# Altium schematic sheet 5-gsm.SchDoc
size B
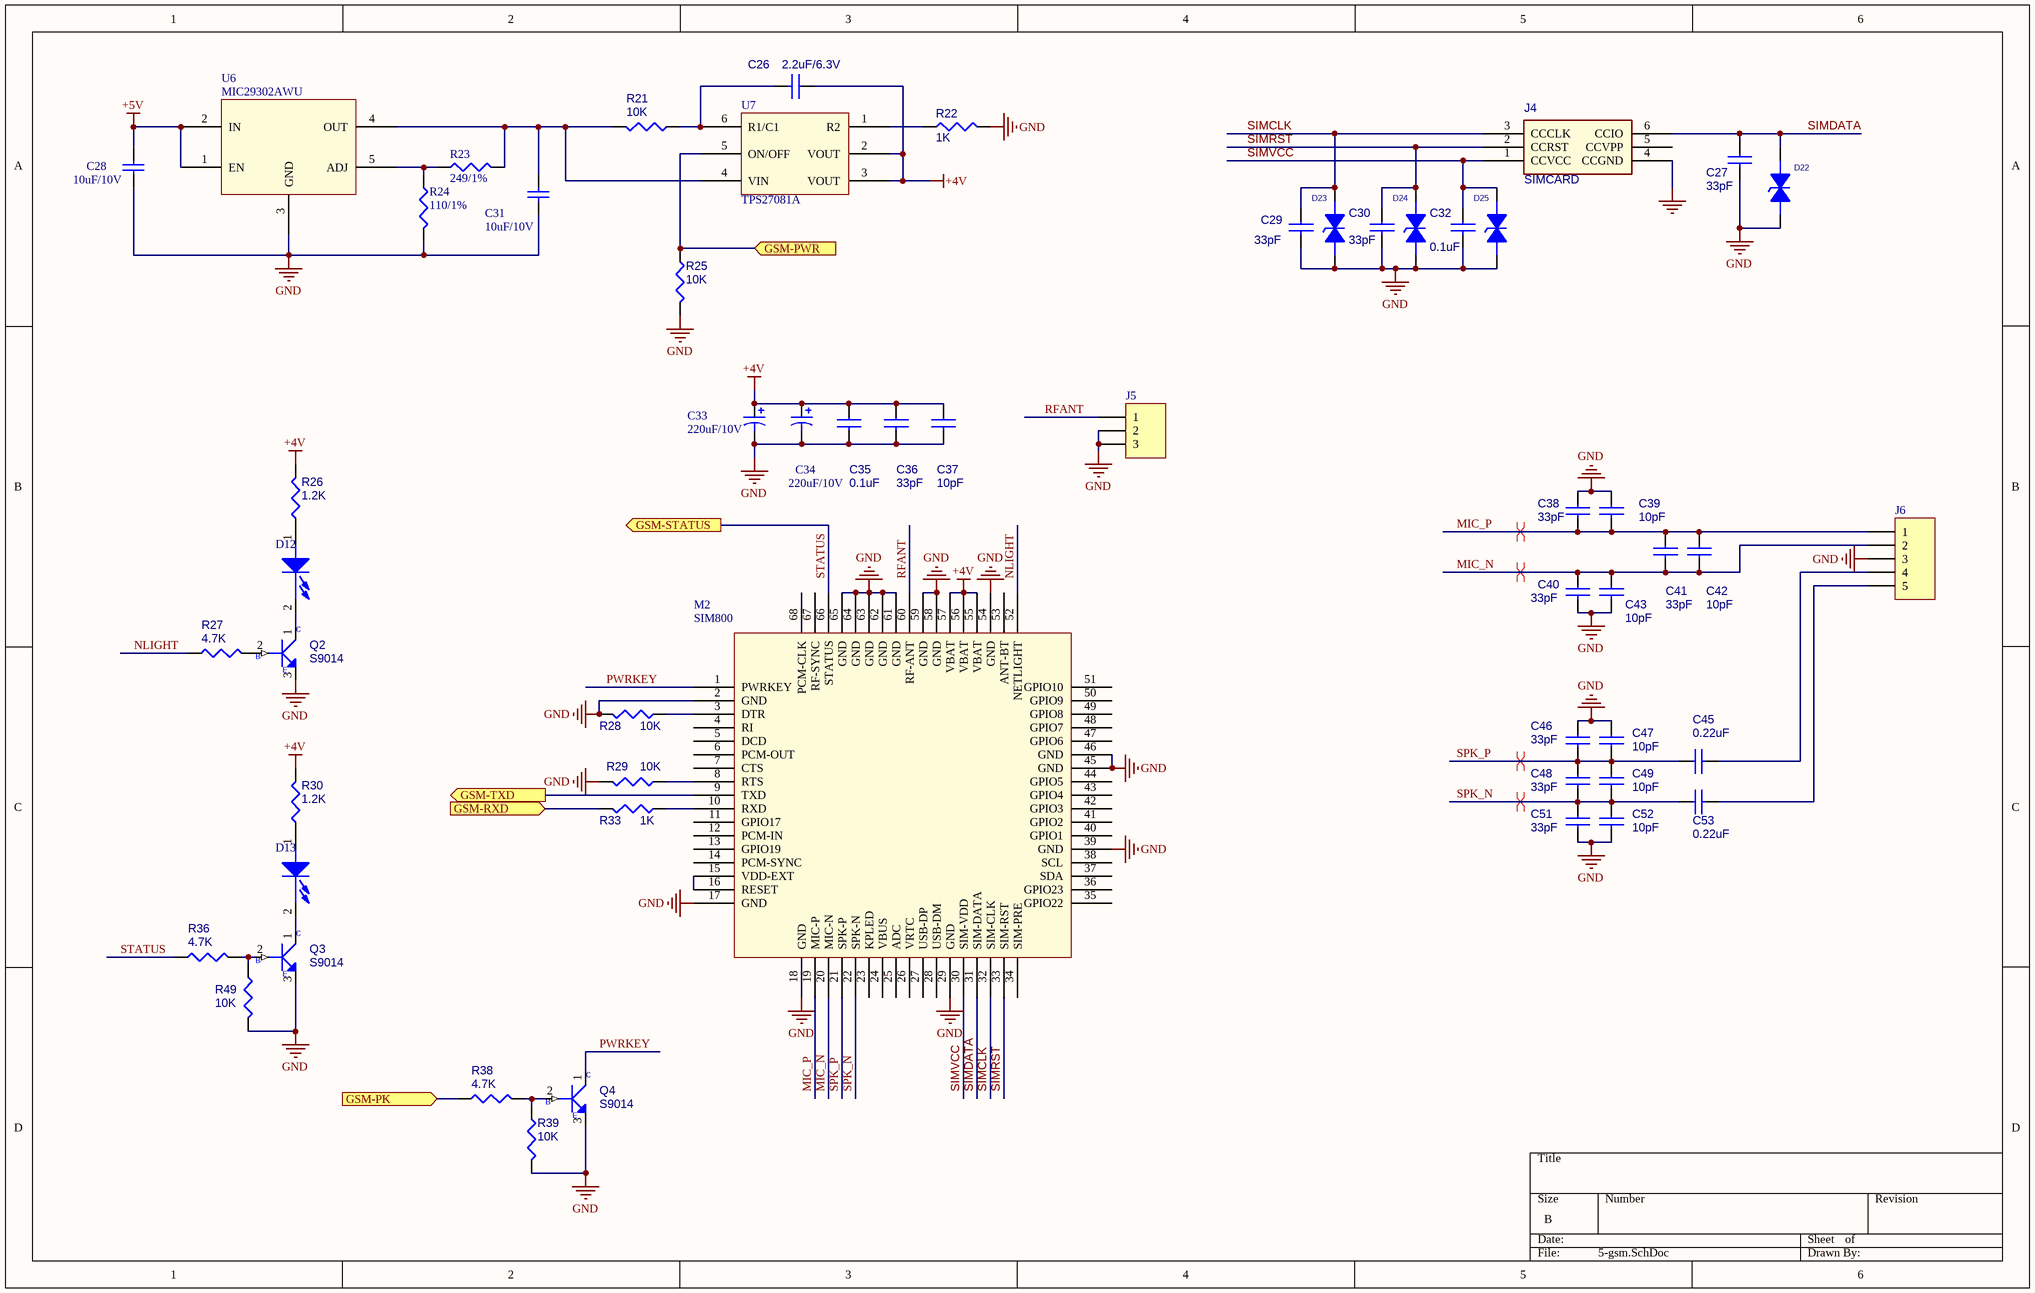
[diagram p0: 5-gsm.SchDoc]

## Parts
C26  2.2uF/6.3V  [0603]
C27  33pF  [0402]
C28  10uF/10V  [1210]
C29  33pF  [0402]
C30  33pF  [0402]
C31  10uF/10V  [1210]
C32  0.1uF  [0402]
C33  220uF/10V  [7343]
C34  220uF/10V  [7343]
C35  0.1uF  [0603]
C36  33pF  [0603]
C37  10pF  [0603]
C38  33pF  [0603]
C39  10pF  [0603]
C40  33pF  [0603]
C41  33pF  [0603]
C42  10pF  [0603]
C43  10pF  [0603]
C45  0.22uF  [0603]
C46  33pF  [0603]
C47  10pF  [0603]
C48  33pF  [0603]
C49  10pF  [0603]
C51  33pF  [0603]
C52  10pF  [0603]
C53  0.22uF  [0603]
D12  LED GREEN  [LED0603]  (value not drawn)
D13  LED GREEN  [LED0603]  (value not drawn)
D22  SMV0402G5R6N121T  [0402]  (value not drawn)
D23  SMV0402G5R6N121T  [0402]  (value not drawn)
D24  SMV0402G5R6N121T  [0402]  (value not drawn)
D25  SMV0402G5R6N121T  [0402]  (value not drawn)
J4  SIMCARD  [SIM_CARD1]
J5  Header 3  [ANT]  (value not drawn)
J6  Header 5  [CON-5PIN]  (value not drawn)
M2  SIM800  [sim800]
Q2  S9014  [NPN]
Q3  S9014  [NPN]
Q4  S9014  [NPN]
R21  10K  [0603]
R22  1K  [0603]
R23  249/1%  [0603]
R24  110/1%  [0603]
R25  10K  [0603]
R26  1.2K  [0603]
R27  4.7K  [0603]
R28  10K  [0603]
R29  10K  [0603]
R30  1.2K  [0603]
R33  1K  [0603]
R36  4.7K  [0603]
R38  4.7K  [0603]
R39  10K  [0603]
R49  10K  [0603]
U6  MIC29302AWU  [TO-263]
U7  TPS27081A  [SOT23-6]

## Ports
GSM-PK (in), GSM-PWR (in), GSM-RXD (in), GSM-STATUS (out), GSM-TXD (out)

## Nets
+4V: C26.1 C33.1 C34.1 C35.1 C36.1 C37.1 M2.55(VBAT) M2.56(VBAT) M2.57(VBAT) R26.1 R30.1 U7.2(VOUT) U7.3(VOUT)
+5V: C28.2 U6.1(EN) U6.2(IN)
GND: C27.2 C28.1 C29.2 C30.2 C31.1 C32.2 C33.2 C34.2 C35.2 C36.2 C37.2 C38.1 C39.1 C40.2 C43.2 C46.1 C47.1 C51.2 C52.2 D22.1 D23.1 D24.1 D25.1 J4.4(CCGND) J5.2 J5.3 J6.3 M2.2(GND) M2.17(GND) M2.18(GND) M2.29(GND) M2.39(GND) M2.45(GND) M2.46(GND) M2.54(GND) M2.58(GND) M2.59(GND) M2.61(GND) M2.62(GND) M2.63(GND) M2.64(GND) M2.65(GND) Q2.3(EMITTER) Q3.3(EMITTER) Q4.3(EMITTER) R22.1 R24.2 R25.1 R28.1 R29.1 R39.1 R49.1 U6.3(GND)
GSM-PK: R38.2 ; port GSM-PK
GSM-PWR: R25.2 U7.5(ON/OFF) ; port GSM-PWR
GSM-RXD: R33.1 ; port GSM-RXD
GSM-TXD: M2.9(TXD) ; port GSM-TXD
MIC_N: C40.1 C41.2 C42.2 C43.1 J6.2 M2.20(MIC-N)
MIC_P: C38.2 C39.2 C41.1 C42.1 J6.1 M2.19(MIC-P)
NLIGHT: M2.52(NETLIGHT) R27.2
PWRKEY: M2.1(PWRKEY) Q4.1(COLLECTOR)
RFANT: J5.1 M2.60(RF-ANT)
SIMCLK: C29.1 D23.2 J4.3(CCCLK) M2.32(SIM-CLK)
SIMDATA: C27.1 D22.2 J4.6(CCIO) M2.31(SIM-DATA)
SIMRST: C30.1 D24.2 J4.2(CCRST) M2.33(SIM-RST)
SIMVCC: C32.1 D25.2 J4.1(CCVCC) M2.30(SIM-VDD)
SPK_N: C48.2 C49.2 C51.1 C52.1 C53.1 M2.22(SPK-N)
SPK_P: C45.1 C46.2 C47.2 C48.1 C49.1 M2.21(SPK-P)
STATUS: M2.66(STATUS) R36.2 ; port GSM-STATUS
NetC26_2: C26.2 R21.2 U7.6(R1/C1)
NetC31_2: C31.2 R21.1 R23.2 U6.4(OUT) U7.4(VIN)
NetC45_2: C45.2 J6.4
NetC53_2: C53.2 J6.5
NetD12_1: D12.1(ANODE) R26.2
NetD12_2: D12.2(CATHODE) Q2.1(COLLECTOR)
NetD13_1: D13.1(ANODE) R30.2
NetD13_2: D13.2(CATHODE) Q3.1(COLLECTOR)
NetM2_3: M2.3(DTR) R28.2
NetM2_8: M2.8(RTS) R29.2
NetM2_10: M2.10(RXD) R33.2
NetM2_15: M2.15(VDD-EXT) M2.16(RESET)
NetQ2_2: Q2.2(BASE) R27.1
NetQ3_2: Q3.2(BASE) R36.1 R49.2
NetQ4_2: Q4.2(BASE) R38.1 R39.2
NetR22_2: R22.2 U7.1(R2)
NetR23_1: R23.1 R24.1 U6.5(ADJ)

Not connected (* = marked no-connect by the designer): J4 5(CCVPP); M2 4(RI) 5(DCD) 6(PCM-OUT) 7(CTS) 11(GPIO17) 12(PCM-IN) 13(GPIO19) 14(PCM-SYNC) 23(KPLED) 24(VBUS) 25(ADC) 26(VRTC) 27(USB-DP) 28(USB-DM) 34(SIM-PRE) 35(GPIO22) 36(GPIO23) 37(SDA) 38(SCL) 40(GPIO1) 41(GPIO2) 42(GPIO3) 43(GPIO4) 44(GPIO5) 47(GPIO6) 48(GPIO7) 49(GPIO8) 50(GPIO9) 51(GPIO10) 53(ANT-BT) 67(RF-SYNC) 68(PCM-CLK)

## Layout directives
differential pair: MIC_N, MIC_P, SPK_N, SPK_P

## Notes on the sheet
- (in symbol MMBT3904_NL_SOT23-3) C; B; E

## Library data of the parts
C26 C27 C29 C30 C32 C35-C43 C45-C49 C51-C53 = P_CAP NP
C28 C31 = Cap: Capacitor; Value: 0.1uF; Published: 8-Jun-2000; LatestRevisionDate: 17-Jul-2002; LatestRevisionNote: Re-released for DXP Platform.; PackageReference: RAD-0.3; Publisher: Altium Limited; PackageDescription: Radial Cap, Thru-Hole; 2 Leads; 0.3 in Pin Spacing
C33 C34 = Cap Pol1: Polarized Capacitor (Radial); Published: 8-Jun-2000; LatestRevisionDate: 17-Jul-2002; LatestRevisionNote: Re-released for DXP Platform.; PackageReference: RB7.6-15; Publisher: Altium Limited; PackageDescription: Polarized Capacitor (Radial); 2 Leads; Value: 220uF/10V
D12 D13 = LN01401_1
D22-D25 = PESD
J5 = Header 3: Header, 3-Pin; LatestRevisionDate: 17-Jul-2002; LatestRevisionNote: Re-released for DXP Platform.; Publisher: Altium Limited
J6 = Header 5: Header, 5-Pin; LatestRevisionDate: 17-Jul-2002; LatestRevisionNote: Re-released for DXP Platform.; Publisher: Altium Limited
Q2-Q4 = MMBT3904_NL_SOT23-3: Part Description: S TR MMBT3904_NL NPN SOT23; Part Number: SB039040000
R21 R22 R25-R30 R33 R36 R38 R39 R49 = P_R
R23 R24 = Res3: Resistor; Value: 1K; Published: 8-Jun-2000; LatestRevisionDate: 29-May-2009; LatestRevisionNote: IPC-7351 Footprint Added.; PackageReference: J1-0603; Publisher: Altium Limited; PackageDescription: Chip Resistor